# Altium project LUXCON 1_24B.PrjPcb
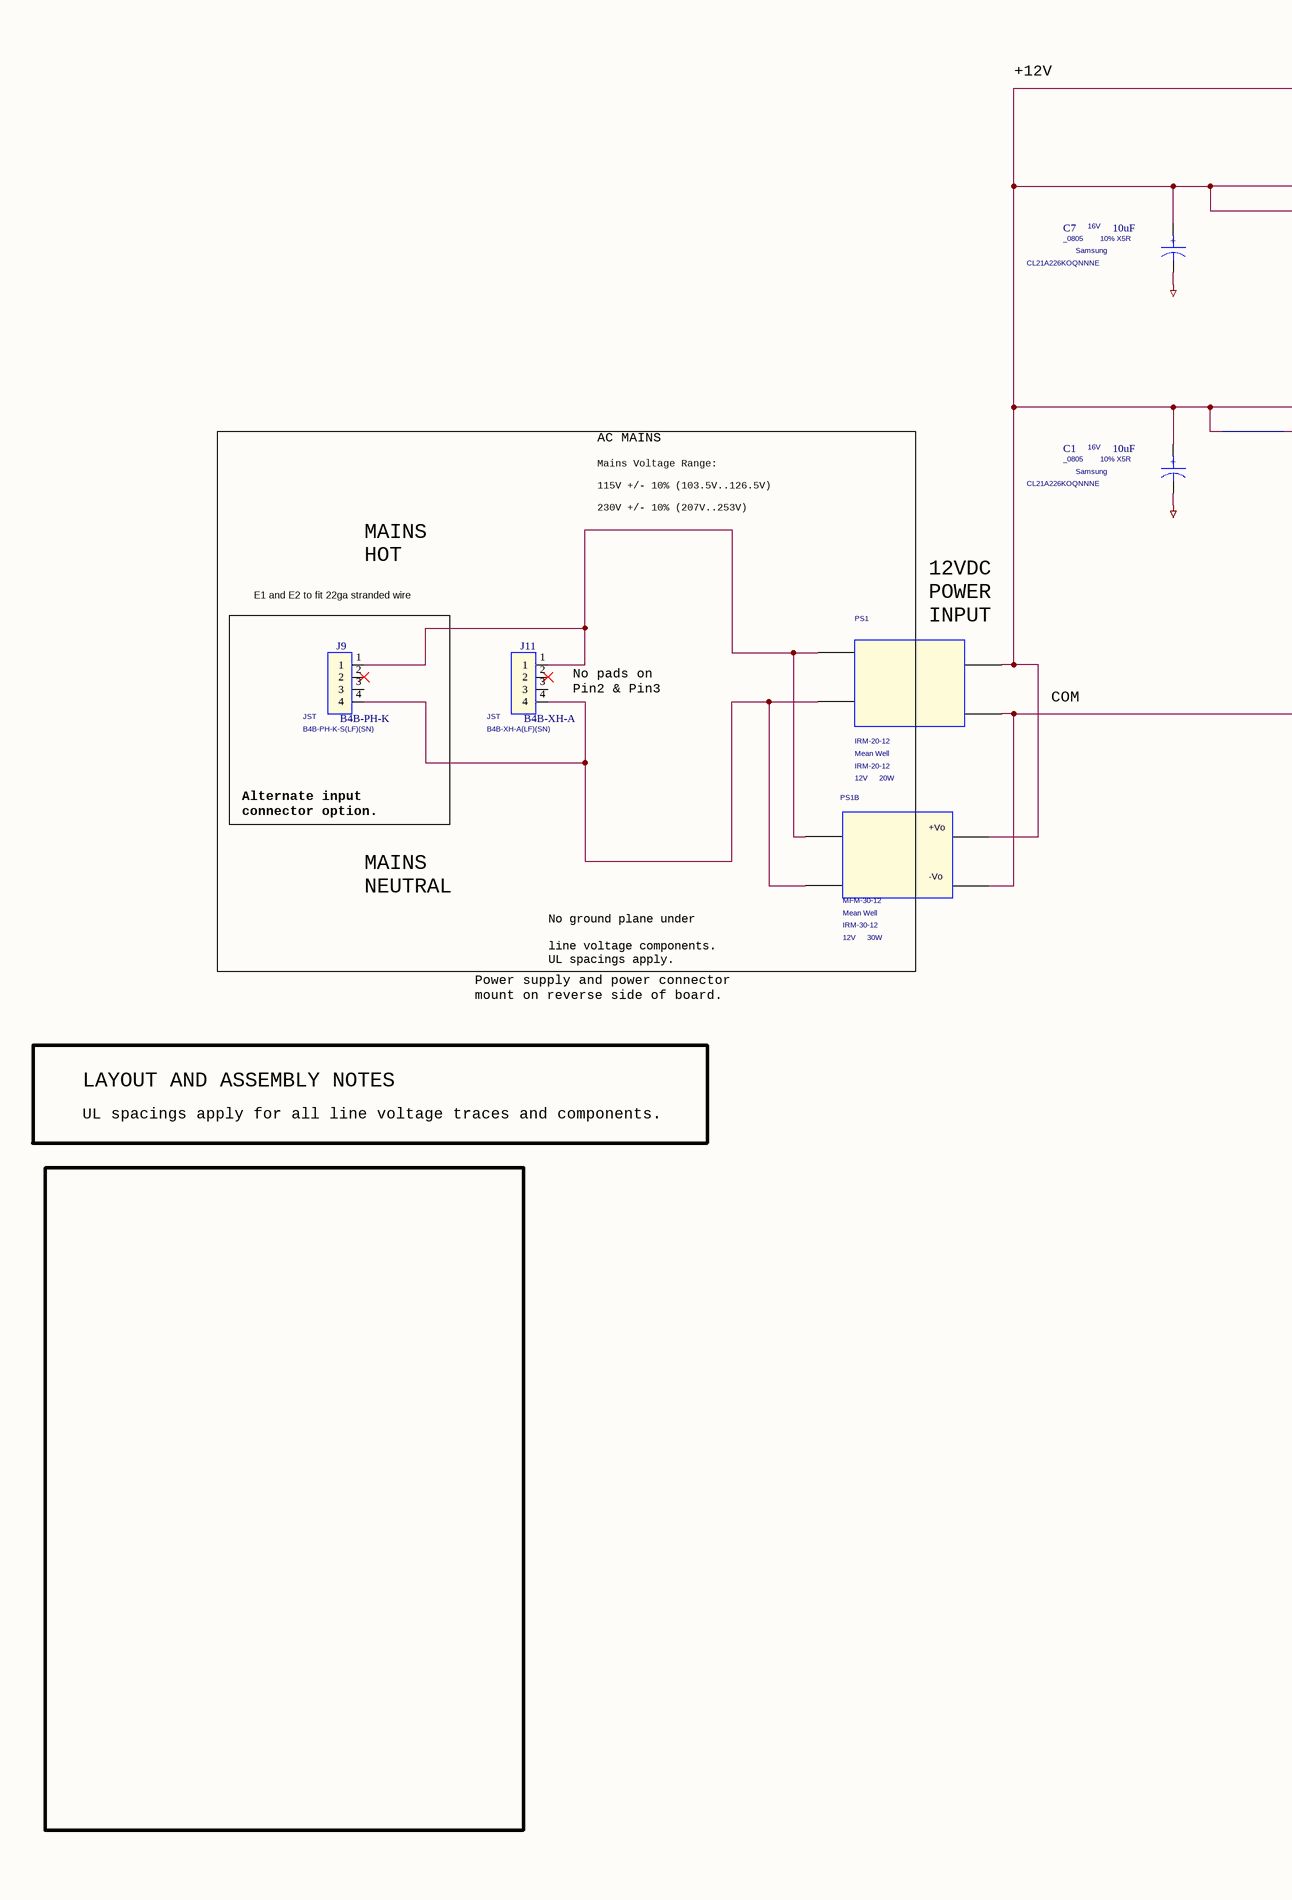
[diagram p0: PAGE1-Power.SchDoc, left]
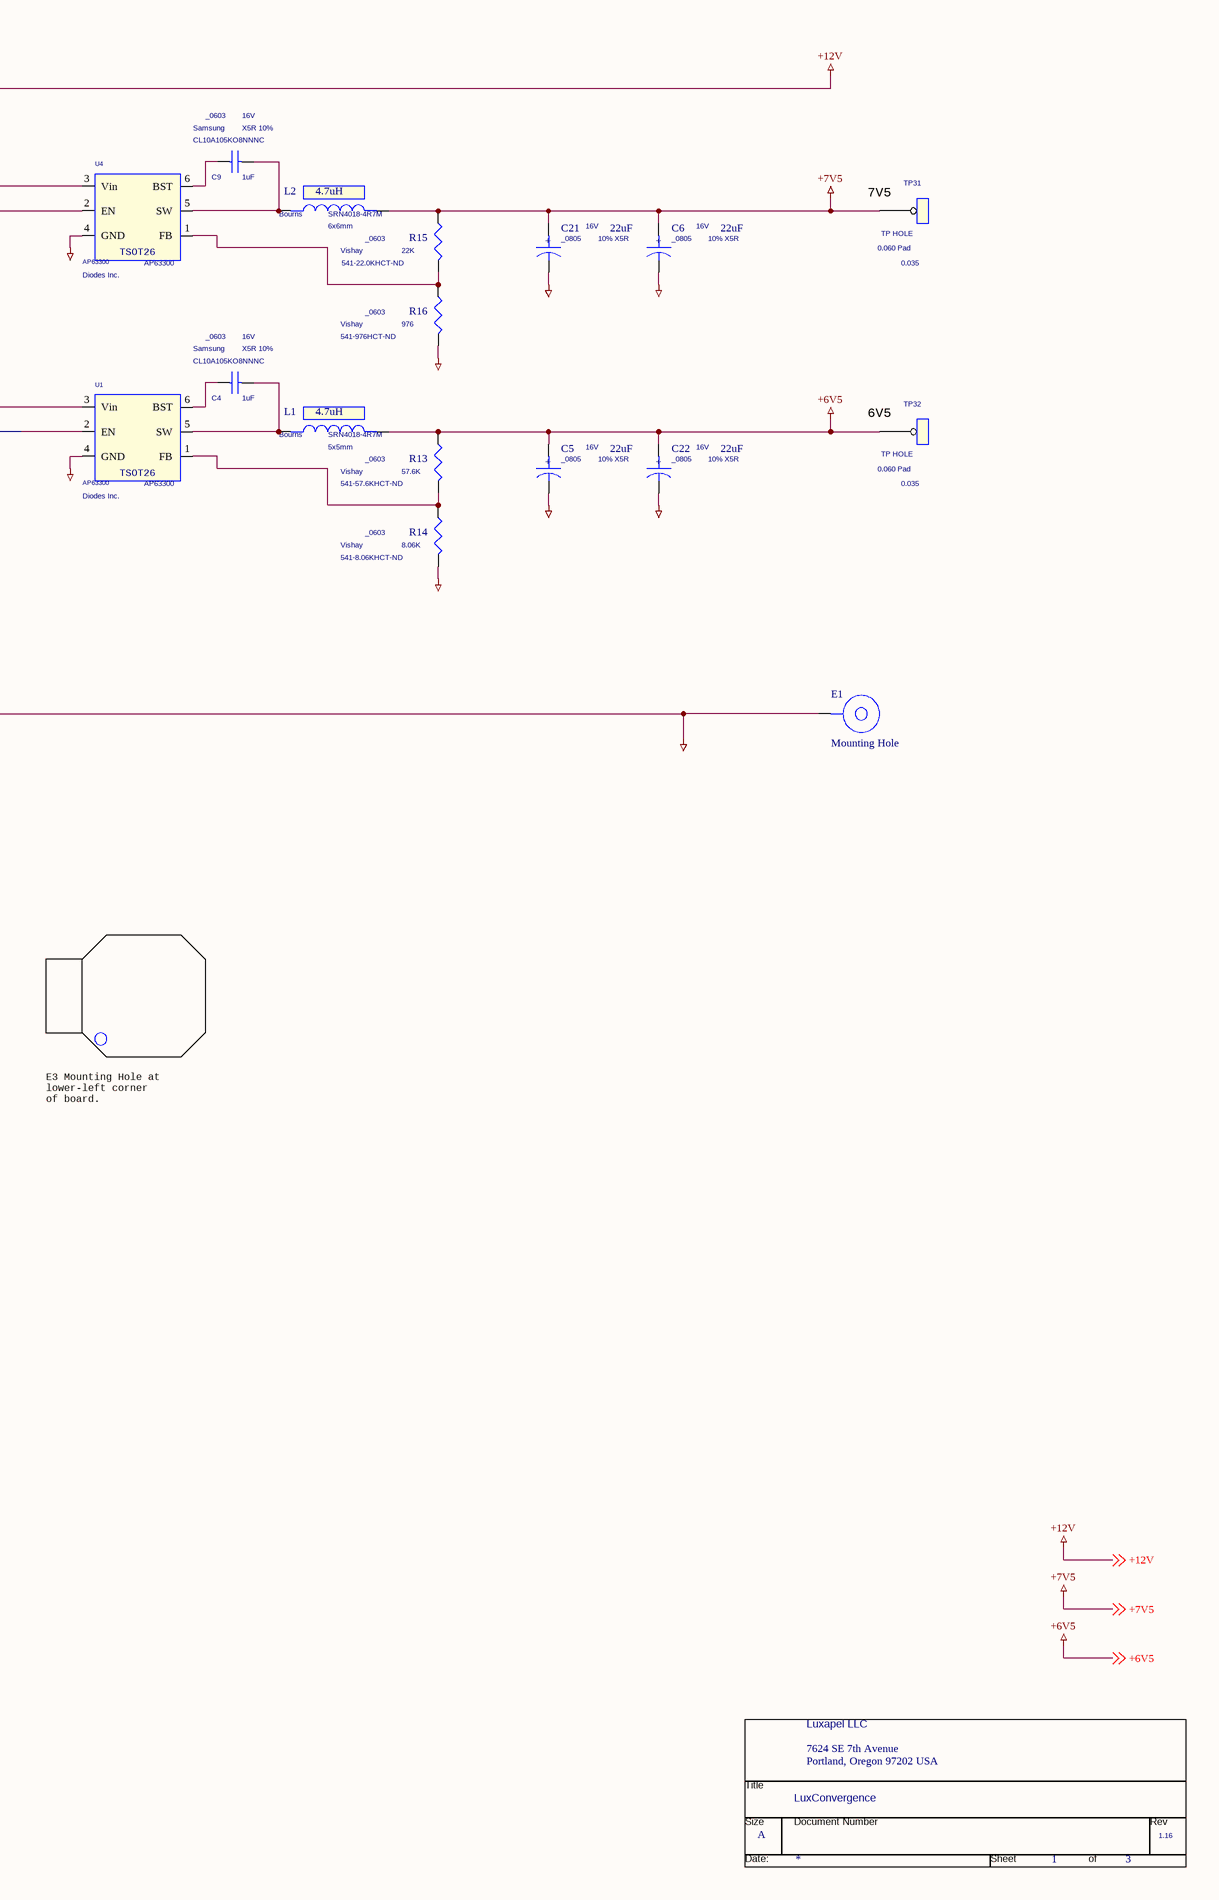
[diagram p1: PAGE1-Power.SchDoc, right]
3 sheets, 67 parts. Net scope: global (net labels, ports and power ports of the same name join across sheets).
Board file: LUX_35.PcbDoc
Sheets:
  PAGE1-Power.SchDoc
  PAGE2-CPU.SchDoc
  PAGE3-LED_Drivers.SchDoc

## Sheet PAGE1-Power.SchDoc
size 513 x 386 mm

### Parts
(Parts that share a designator on the sheet are numbered #1, #2 ... from top to bottom, then left to right.)
*#1  RevCode: 1.16  Title: LuxConvergence  OrgName: Luxapel LLC  OrgAddr1: 7624 SE 7th Avenue  OrgAddr2: Portland, Oregon 97202 USA  Page Size: A  Page Number: 1  Page Count: 3  (hidden comment: TitleBlock3)  (graphical)
C1  10uF  Precision: 10% X5R  Voltage: 16V  Mfg: Samsung  P/N: CL21A226KOQNNNE  [_0805]
C4  1uF  Precision: X5R 10%  Voltage: 16V  Mfg: Samsung  P/N: CL10A105KO8NNNC  [_0603]
C5  22uF  Precision: 10% X5R  Voltage: 16V  [_0805]
C6  22uF  Precision: 10% X5R  Voltage: 16V  [_0805]
C7  10uF  Precision: 10% X5R  Voltage: 16V  Mfg: Samsung  P/N: CL21A226KOQNNNE  [_0805]
C9  1uF  Precision: X5R 10%  Voltage: 16V  Mfg: Samsung  P/N: CL10A105KO8NNNC  [_0603]
C21  22uF  Voltage: 16V  Precision: 10% X5R  [_0805]
C22  22uF  Voltage: 16V  Precision: 10% X5R  [_0805]
E1  Mounting Hole  [MountingHole]
J9  B4B-PH-K  P/N: B4B-PH-K-S(LF)(SN)  Mfg: JST  [SIP-4]
J11  B4B-XH-A  P/N: B4B-XH-A(LF)(SN)  Mfg: JST  [SIP-4]
L1  4.7uH  P/N: SRN4018-4R7M  Mfg: Bourns  [5x5mm]
L2  4.7uH  Mfg: Bourns  P/N: SRN4018-4R7M  [6x6mm]
PS1  IRM-20-12  Mfg: Mean Well  Voltage: 12V  Power: 20W  [ThruHolePS]
PS1B  MFM-30-12  Mfg: Mean Well  P/N: IRM-30-12  Voltage: 12V  Power: 30W  [THRUHOLEPS - duplicate]
R13  57.6K  P/N: 541-57.6KHCT-ND  Mfg: Vishay  [_0603]
R14  8.06K  P/N: 541-8.06KHCT-ND  Mfg: Vishay  [_0603]
R15  22K  P/N: 541-22.0KHCT-ND  Mfg: Vishay  [_0603]
R16  976  P/N: 541-976HCT-ND  Mfg: Vishay  [_0603]
TP31  TP HOLE  Notes: 0.060 Pad  [0.035]
TP32  TP HOLE  Notes: 0.060 Pad  [0.035]
U1  AP63300  Mfg: Diodes Inc.  [SOIC-8]
U4  AP63300  Mfg: Diodes Inc.  [SOIC-8]

### Blocks framed on the sheet
AC MAINS: J11 PS1 PS1B
E1 and E2 to fit 22ga stranded wire: J9

### Nets
+6V5: C5.1 C22.1 L1.1 R13.1 TP32.1 ; off-sheet +6V5
+7V5: C6.1 C21.1 L2.1 R15.1 TP31.1 ; off-sheet +7V5
+12V: C1.1 C7.1 PS1.+Vo PS1B.+Vo U1.2(EN) U1.3(Vin) U4.2(EN) U4.3(Vin) ; off-sheet +12V
GND_POWER.global: C1.2 C5.2 C6.2 C7.2 C21.2 C22.2 E1.1 PS1.-Vo PS1B.-Vo R14.2 R16.2 U1.4(GND) U4.4(GND)
NetC4_1: C4.1 U1.6(BST)
NetC4_2: C4.2 L1.2 U1.5(SW)
NetC9_1: C9.1 U4.6(BST)
NetC9_2: C9.2 L2.2 U4.5(SW)
NetJ9_1: J9.1 J11.1 PS1.ACL PS1B.ACN
NetJ9_4: J9.4 J11.4 PS1.ACN PS1B.ACL
NetR13_2: R13.2 R14.1 U1.1(FB)
NetR15_2: R15.2 R16.1 U4.1(FB)

Not connected (* = marked no-connect by the designer): J9 2* 3; J11 2* 3

### Notes on the sheet
- +12V
- (near TP31) 7V5
- (near TP32) 6V5
- Mains Voltage Range:
  115V +/- 10% (103.5V..126.5V)
  230V +/- 10% (207V..253V)
- MAINS
  HOT
- (near PS1) 12VDC
  POWER
  INPUT
- (near J11) No pads on
  Pin2 & Pin3
- COM
- Alternate input
  connector option.
- (near PS1B) +Vo
- MAINS
  NEUTRAL
- (near PS1B) -Vo
- No ground plane under
  line voltage components.
  UL spacings apply.
- Power supply and power connector
  mount on reverse side of board.
- LAYOUT AND ASSEMBLY NOTES
- E3 Mounting Hole at
  lower-left corner
  of board.
- UL spacings apply for all line voltage traces and components.
- (in symbol CAPACITOR POL/SM) +
- (in symbol NCP3170_0_2) TSOT26
- (in symbol TitleBlock3) Title; Size; Document Number; Rev; Date:; Sheet; of

### Library data of the parts
*#1 = TitleBlock3: Doc: LuxConvergence_1_0; Page Create Date: March  8, 1995; Page Modify Date: *
C1 C7 = CAPACITOR POL/SM: PCB Footprint: _0805
C4 C9 = CAPACITOR NON-POL: Name: I16777427; Pin Numbers Visible: False; EDIForiginalOrigin: (pt 0 0); EDIFviewName: NORMAL; Implementation Type: <none>; Color: Default; Pin Names Visible: False; Graphic: CAPACITOR NON-POL; DataSheet: Yes; PCB Footprint: _0603
C5 C6 = CAPACITOR POL/SM: Mfg: Samsung; P/N: CL21A226KOQNNNE; PCB Footprint: _0805
C21 C22 = CAPACITOR POL/SM: P/N: CL21A226KOQNNNE; Mfg: Samsung; PCB Footprint: _0805
E1 = hole_0: OrCADviewType: LIBRARY_PART; Name: hole.Normal; Pin Numbers Visible: False; EDIForiginalOrigin: (pt 0 10); EDIFviewName: NORMAL; Pin Names Visible: False; PCB Footprint: MountingHole
J9 J11 = CON4_8: DataSheet: Yes; PCB Footprint: SIP-4
L1 L2 = INDUCTOR FERRITE/SM: Power: 1A
  L1: PCB Footprint: 5x5mm
  L2: PCB Footprint: 6x6mm
PS1 = VOFM-5-5: Pin Numbers Visible: True; EDIForiginalOrigin: (pt 0 0); EDIFviewName: NORMAL; Implementation Type: <none>; Graphic: VOFM-5-5.Normal; Pin Names Visible: True; PCB Footprint: ThruHolePS; Color: Default; P/N: IRM-20-12; DataSheet: Yes
PS1B = VOFM-5-5_5: EDIFviewName: NORMAL; EDIForiginalOrigin: (pt 0 0); Pin Names Visible: True; Implementation Type: <none>; Graphic: VOFM-5-5.Normal; PCB Footprint: ThruHolePS; Pin Numbers Visible: True; Color: Default; DataSheet: Yes
R13-R16 = RESISTOR: Voltage: 75V; Precision: 5%; Power: 0.10W; PCB Footprint: _0603
TP31 TP32 = TEST POINT_1: OrCADviewType: LIBRARY_PART; Name: I16753259; Pin Numbers Visible: False; Pin Names Visible: True; EDIForiginalOrigin: (pt 0 0); EDIFviewName: NORMAL; Implementation Type: <none>; PCB Footprint: 0.035; Color: Default; Graphic: TEST POINT; DataSheet: Yes
U1 U4 = NCP3170_0_2: PCB Footprint: SOIC-8; P/N: AP63300

## Sheet PAGE2-CPU.SchDoc
size 513 x 386 mm
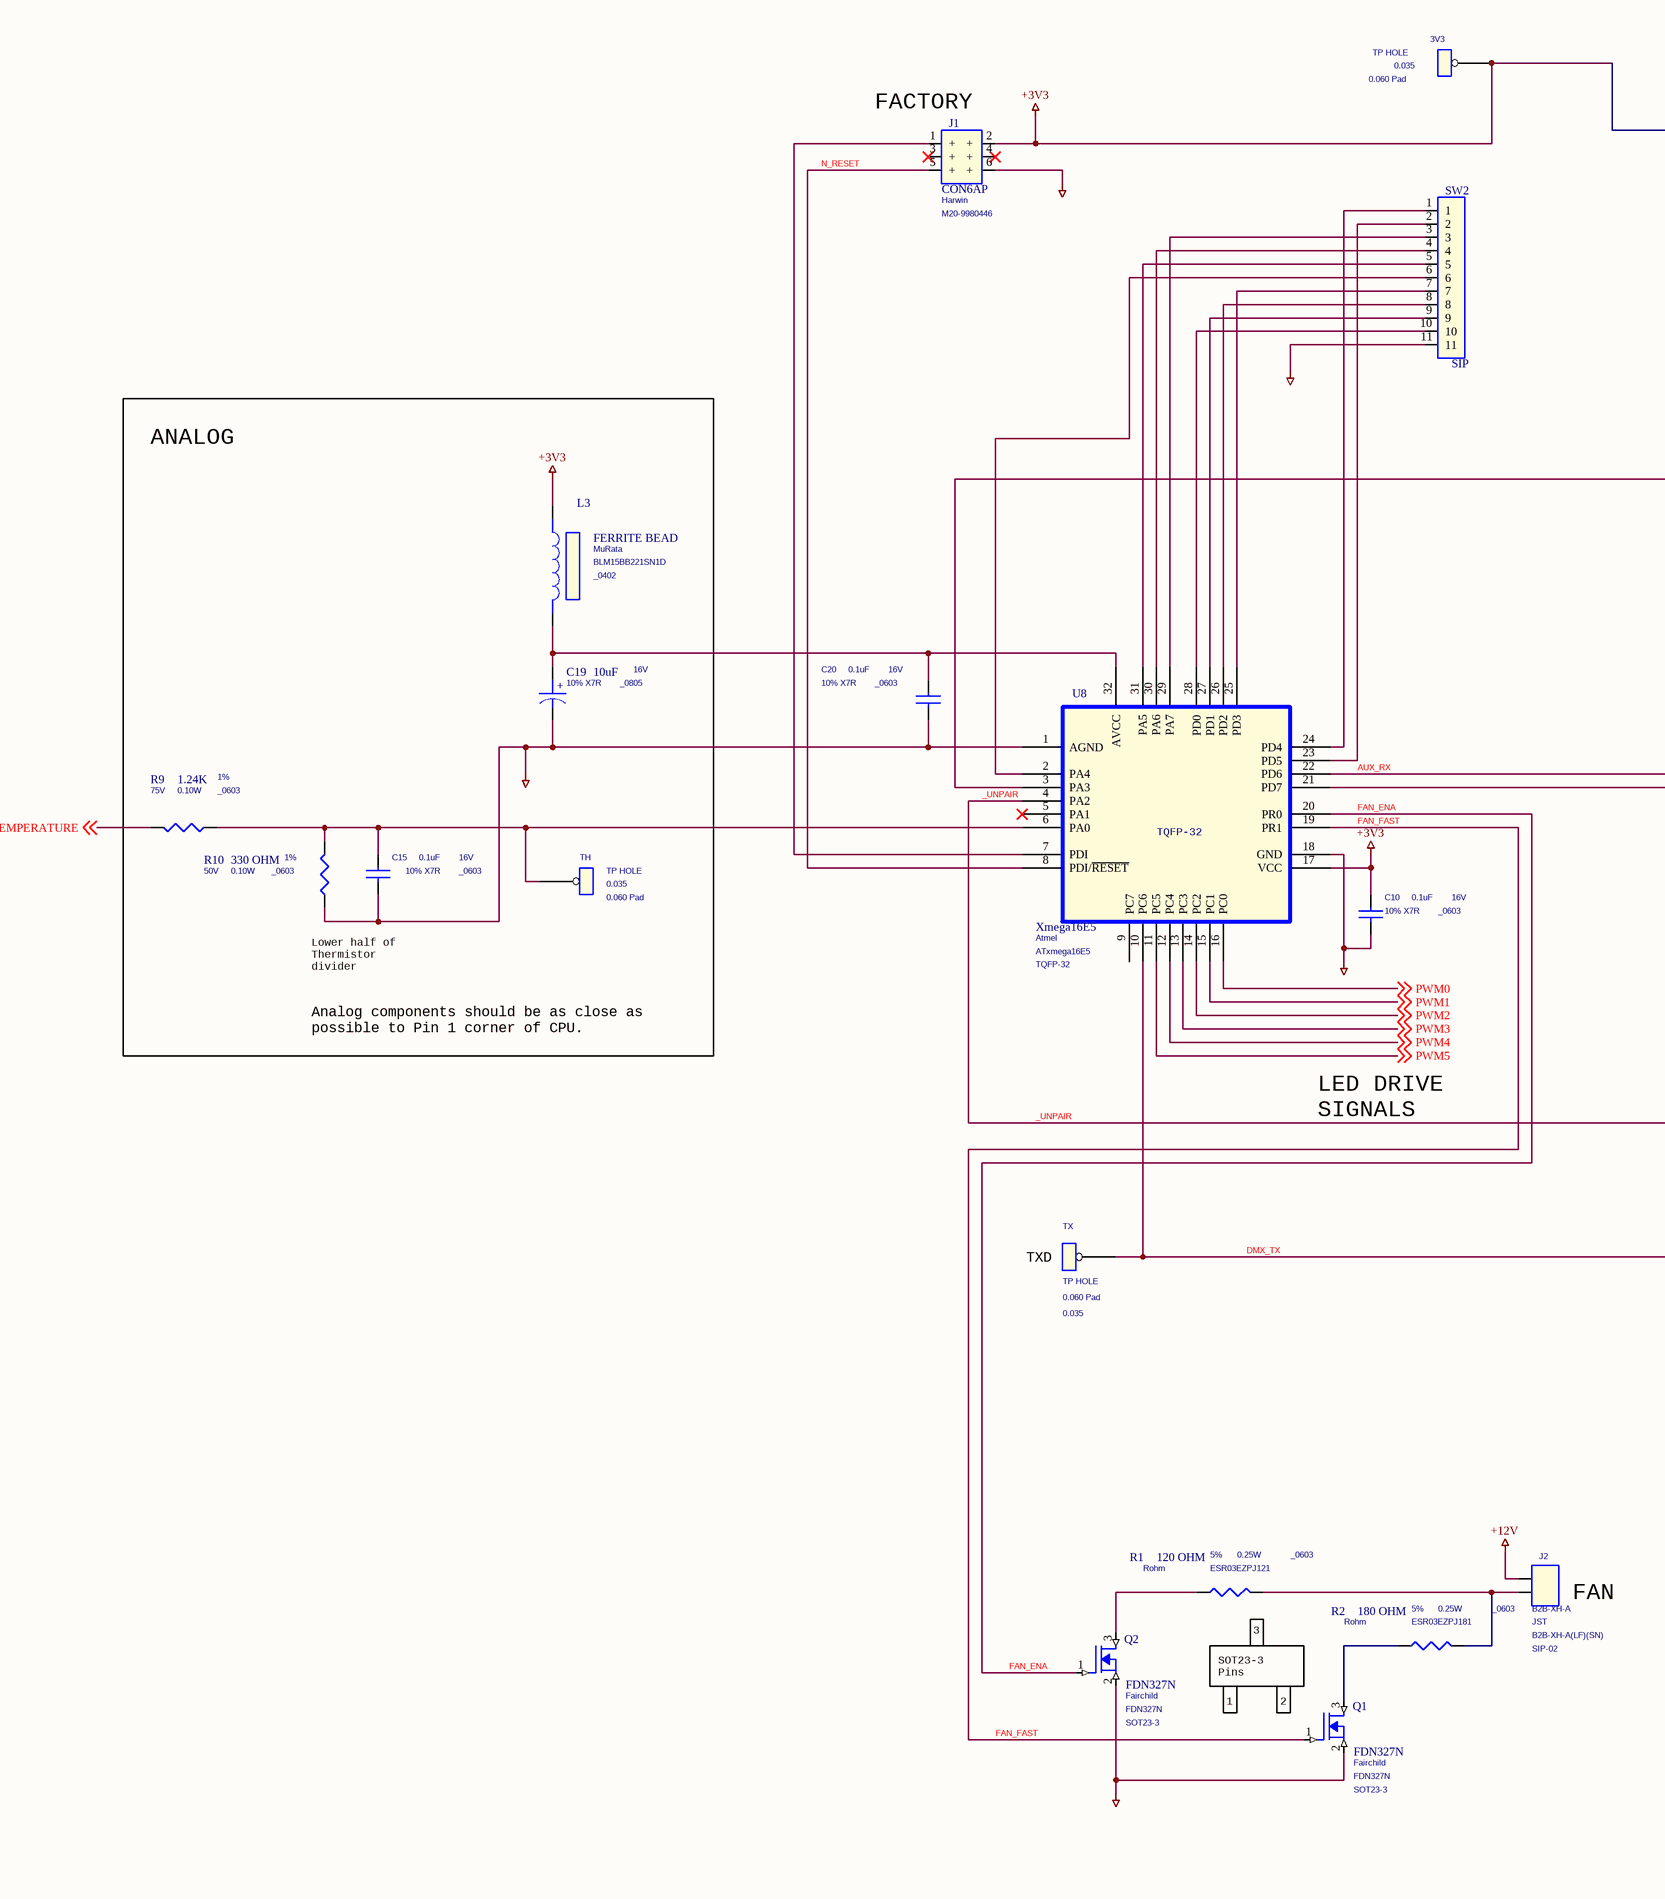
[diagram p2: PAGE2-CPU.SchDoc, left]
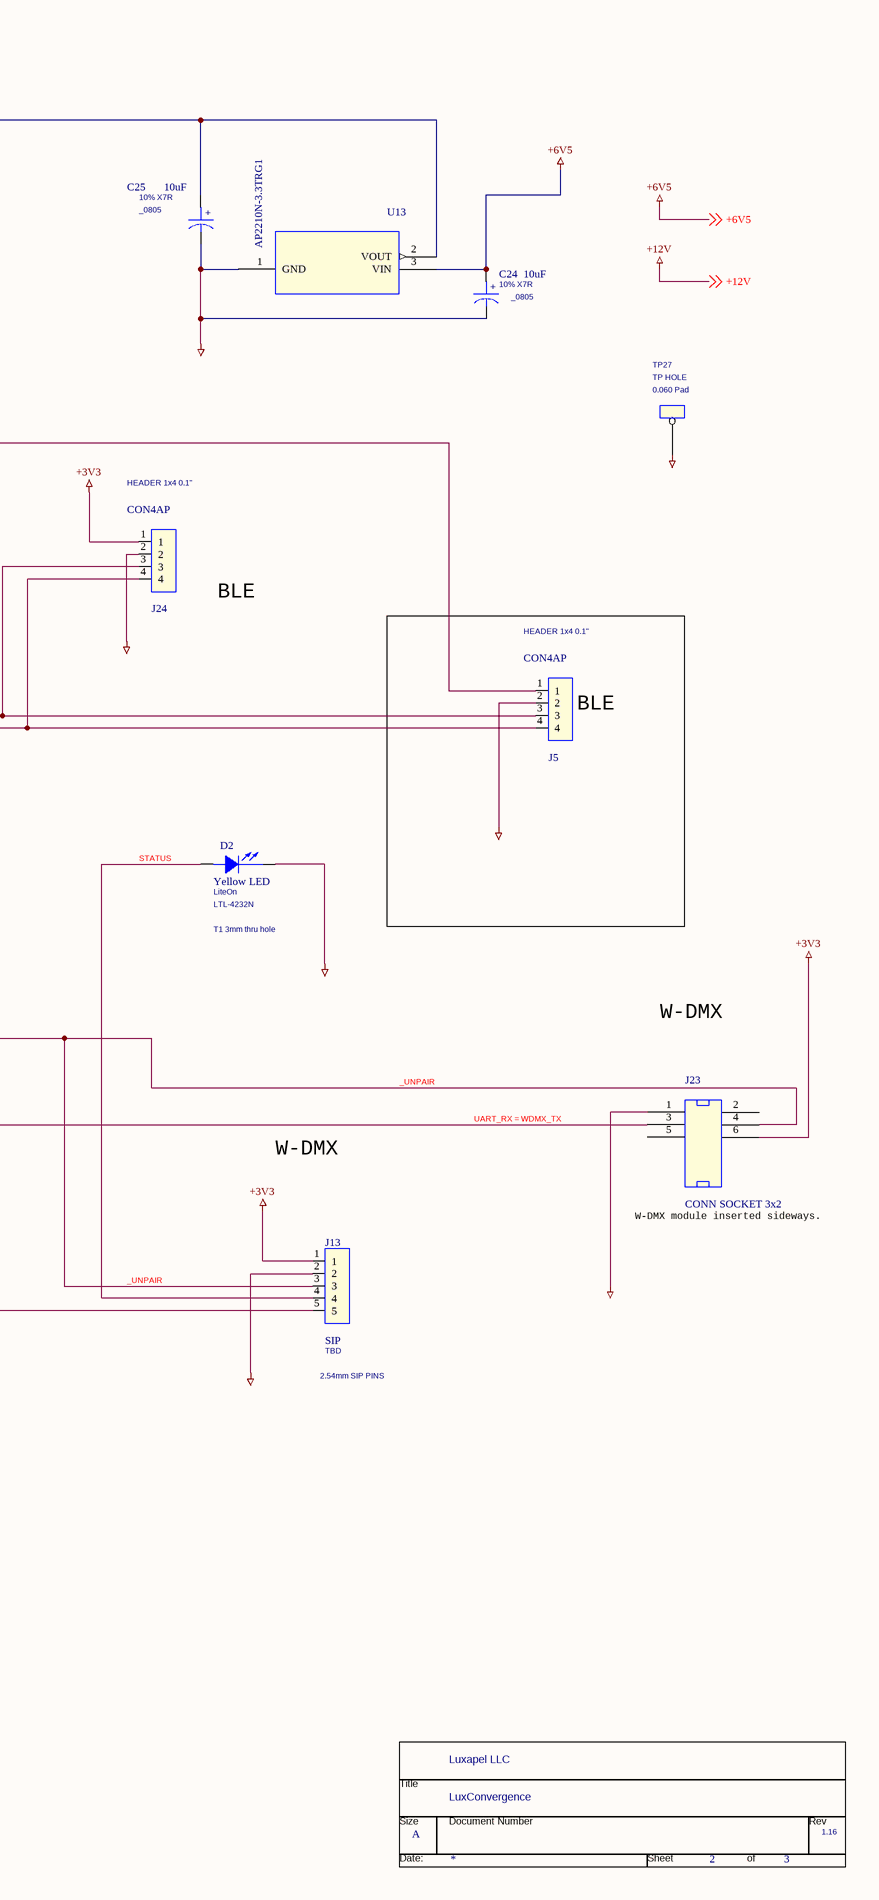
[diagram p3: PAGE2-CPU.SchDoc, right]

### Parts
(Parts that share a designator on the sheet are numbered #1, #2 ... from top to bottom, then left to right.)
3V3  TP HOLE  Notes: 0.060 Pad  [0.035]
*#2  RevCode: 1.16  Title: LuxConvergence  OrgName: Luxapel LLC  Page Size: A  Page Number: 2  Page Count: 3  (hidden comment: TitleBlock1)  (graphical)
C10  0.1uF  Voltage: 16V  Precision: 10% X7R  [_0603]
C15  0.1uF  Precision: 10% X7R  Voltage: 16V  [_0603]
C19  10uF  Voltage: 16V  Precision: 10% X7R  [_0805]
C20  0.1uF  Precision: 10% X7R  Voltage: 16V  [_0603]
C24  10uF  Precision: 10% X7R  [_0805]
C25  10uF  Precision: 10% X7R  [_0805]
D2  Yellow LED  Mfg: LiteOn  P/N: LTL-4232N  [T1 3mm thru hole]
J1  CON6AP  Mfg: Harwin  P/N: M20-9980446  [2x4]
J2  B2B-XH-A  P/N: B2B-XH-A(LF)(SN)  Mfg: JST  [SIP-02]
J5  CON4AP  [HEADER 1x4 0.1"]
J13  SIP  Mfg: TBD  P/N: 2.54mm SIP PINS  [SIP-4]
J23  CONN SOCKET 3x2  [2X3]
J24  CON4AP  PCB Footprint: HEADER 1x4 0.1"  [SIP-4PA]
L3  FERRITE BEAD  Mfg: MuRata  P/N: BLM15BB221SN1D  [_0402]
Q1  FDN327N  Mfg: Fairchild  [SOT23-3]
Q2  FDN327N  Mfg: Fairchild  [SOT23-3]
R1  120 OHM  Precision: 5%  Power: 0.25W  P/N: ESR03EZPJ121  Mfg: Rohm  [_0603]
R2  180 OHM  Precision: 5%  Power: 0.25W  P/N: ESR03EZPJ181  Mfg: Rohm  [_0603]
R9  1.24K  Power: 0.10W  Voltage: 75V  Precision: 1%  [_0603]
R10  330 OHM  Voltage: 50V  Precision: 1%  Power: 0.10W  [_0603]
SW2  SIP  [SIP-4]
TH  TP HOLE  Notes: 0.060 Pad  [0.035]
TP27  TP HOLE  Notes: 0.060 Pad  [0.035]
TX  TP HOLE  Notes: 0.060 Pad  [0.035]
U8  Xmega16E5  P/N: ATxmega16E5  Mfg: Atmel  [TQFP-32]
U13  AP2210N-3.3TRG1  [FP-SOT23-IPC_A]

### Blocks framed on the sheet
ANALOG: C15 C19 L3 R9 R10 TH
BLE: J5

### Nets
+3V3: 3V3.1 C10.1 C25.1 J1.2(+) J13.1 J23.6 J24.1 L3.2 U8.17(VCC) U13.2(VOUT)
+6V5: C24.1 U13.3(VIN) ; off-sheet +6V5
+12V: J2.1 ; off-sheet +12V
GND_POWER.global: C10.2 C15.2 C19.2 C20.2 C24.2 C25.2 D2.2(CATHODE) J1.6(+) J5.2 J13.2 J23.1 J24.2 Q1.2(SOURCE) Q2.2(SOURCE) R10.2 SW2.11 TP27.1 U8.1(AGND) U8.18(GND) U13.1(GND)
_UNPAIR: J13.3 J23.4 U8.4(PA2)
AUX_RX: J5.3 J24.3 U8.22(PD6)
DMX_TX: J13.5 J23.3 TX.1 U8.10(PC6)  [also labelled UART_RX = WDMX_TX]
FAN_ENA: Q2.1(GATE) U8.20(PR0)
FAN_FAST: Q1.1(GATE) U8.19(PR1)
N_RESET: J1.5(+) U8.8(PDI/~{RESET})
PWM0: U8.16(PC0) ; off-sheet PWM0
PWM1: U8.15(PC1) ; off-sheet PWM1
PWM2: U8.14(PC2) ; off-sheet PWM2
PWM3: U8.13(PC3) ; off-sheet PWM3
PWM4: U8.12(PC4) ; off-sheet PWM4
PWM5: U8.11(PC5) ; off-sheet PWM5
STATUS: D2.1(ANODE) J13.4
TEMPERATURE: R9.1 ; off-sheet TEMPERATURE
NetC15_1: C15.1 R9.2 R10.1 TH.1 U8.6(PA0)
NetC19_1: C19.1 C20.1 L3.1 U8.32(AVCC)
NetJ1_1: J1.1(+) U8.7(PDI)
NetJ2_2: J2.2 R1.2 R2.2
NetJ5_1: J5.1 U8.3(PA3)
NetJ5_4: J5.4 J24.4 U8.21(PD7)
NetQ1_3: Q1.3(DRAIN) R2.1
NetQ2_3: Q2.3(DRAIN) R1.1
NetSW2_1: SW2.1 U8.24(PD4)
NetSW2_2: SW2.2 U8.23(PD5)
NetSW2_3: SW2.3 U8.29(PA7)
NetSW2_4: SW2.4 U8.30(PA6)
NetSW2_5: SW2.5 U8.31(PA5)
NetSW2_6: SW2.6 U8.2(PA4)
NetSW2_7: SW2.7 U8.25(PD3)
NetSW2_8: SW2.8 U8.26(PD2)
NetSW2_9: SW2.9 U8.27(PD1)
NetSW2_10: SW2.10 U8.28(PD0)

Not connected (* = marked no-connect by the designer): J1 3(+)* 4(+)*; J23 2(7) 5(3); U8 5(PA1)* 9(PC7)

### Notes on the sheet
- (near J1) FACTORY
- BLE
- Lower half of
  Thermistor
  divider
- Analog components should be as close as
  possible to Pin 1 corner of CPU.
- LED DRIVE
  SIGNALS
- W-DMX
- (near TX) TXD
- W-DMX module inserted sideways.
- (near R1) 3
- (near J2) FAN
- SOT23-3
  Pins
- 1
- (near Q1) 2
- (in symbol CAPACITOR POL/SM) +
- (in symbol TitleBlock1) Title; Size; Document Number; Rev; Date:; Sheet; of

### Library data of the parts
3V3 TH TP27 TX = TEST POINT_1: as TP31 on sheet PAGE1-Power; DataSheet: Yes; Graphic: TEST POINT; Color: Default; PCB Footprint: 0.035
*#2 = TitleBlock1: Doc: LuxConvergence_1_0; Page Create Date: March  8, 1995; Page Modify Date: *
C10 = CAPACITOR NON-POL: Name: I16777427; Pin Numbers Visible: False; EDIForiginalOrigin: (pt 0 0); EDIFviewName: NORMAL; Implementation Type: <none>; Color: Default; Mfg: AVX; P/N: 0603YC104KAT2A; Pin Names Visible: False; PCB Footprint: _0603; Graphic: CAPACITOR NON-POL; DataSheet: Yes
C15 = CAPACITOR NON-POL: Name: I16777291; Pin Numbers Visible: False; EDIForiginalOrigin: (pt 0 0); EDIFviewName: NORMAL; P/N: 0603YC104KAT2A; Mfg: AVX; Color: Default; Implementation Type: <none>; Pin Names Visible: False; PCB Footprint: _0603; DataSheet: Yes; Graphic: CAPACITOR NON-POL
C19 = CAPACITOR POL/SM: P/N: CL21B106KOQNNNE; Mfg: Samsung; PCB Footprint: _0805
C20 = CAPACITOR NON-POL: Name: I16777427; Pin Numbers Visible: False; EDIForiginalOrigin: (pt 0 0); EDIFviewName: NORMAL; P/N: 0603YC104KAT2A; Mfg: AVX; Color: Default; Implementation Type: <none>; Pin Names Visible: False; DataSheet: Yes; Graphic: CAPACITOR NON-POL; PCB Footprint: _0603
C24 = CAPACITOR POL/SM: Voltage: 16V; Mfg: Samsung; P/N: CL21B106KOQNNNE; PCB Footprint: _0805
C25 = CAPACITOR POL/SM: P/N: CL21B106KOQNNNE; Mfg: Samsung; Voltage: 16V; PCB Footprint: _0805
D2 = LED: PCB Footprint: T1 3mm thru hole
J1 = CON8AP_0: PCB Footprint: 2x4
J2 = CON2: Pin Numbers Visible: True; EDIForiginalOrigin: (pt 0 0); EDIFviewName: NORMAL; Graphic: CON2.Normal; Implementation Type: <none>; Pin Names Visible: True; Color: Default; PCB Footprint: SIP-02
J5 J24 = CON4AP_5
  J5: PCB Footprint: HEADER 1x4 0.1"
J13 = CON4_9: DataSheet: Yes; PCB Footprint: SIP-4
J23 = CONN SOCKET 6x2_0
L3 = INDUCTOR FERRITE/SM: PCB Footprint: _0402
Q1 Q2 = N DGS_0: Voltage: 20V; Power: 2A; P/N: FDN327N; PCB Footprint: SOT23-3
R1 R2 = RESISTOR/SM: Voltage: 50V; PCB Footprint: _0603
R9 = RESISTOR/SM: Mfg: Vishay; P/N: CRCW06031K24FKEB; PCB Footprint: _0603
R10 = RESISTOR/SM: Mfg: Stackpole; P/N: RMCF0603FT330R; PCB Footprint: _0603
SW2 = CON4_10: Mfg: TBD; P/N: 2mm SIP PINS; PCB Footprint: SIP-4; DataSheet: Yes
U8 = Xmega8E5: PCB Footprint: TQFP-32
U13 = AP2210N-3P3TRG1: Vendor: Diodes Inc; Built_By: EMAMatt; SourceLibrary: DiodesInc2019-12-05; PCB Footprint: SOT_3P3TRG1_DIO; Manufacturer_Part_Number: AP2210N-3.3TRG1; Copyright: Copyright (C) 2018 Accelerated Designs. All rights reserved

## Sheet PAGE3-LED_Drivers.SchDoc
size 513 x 386 mm
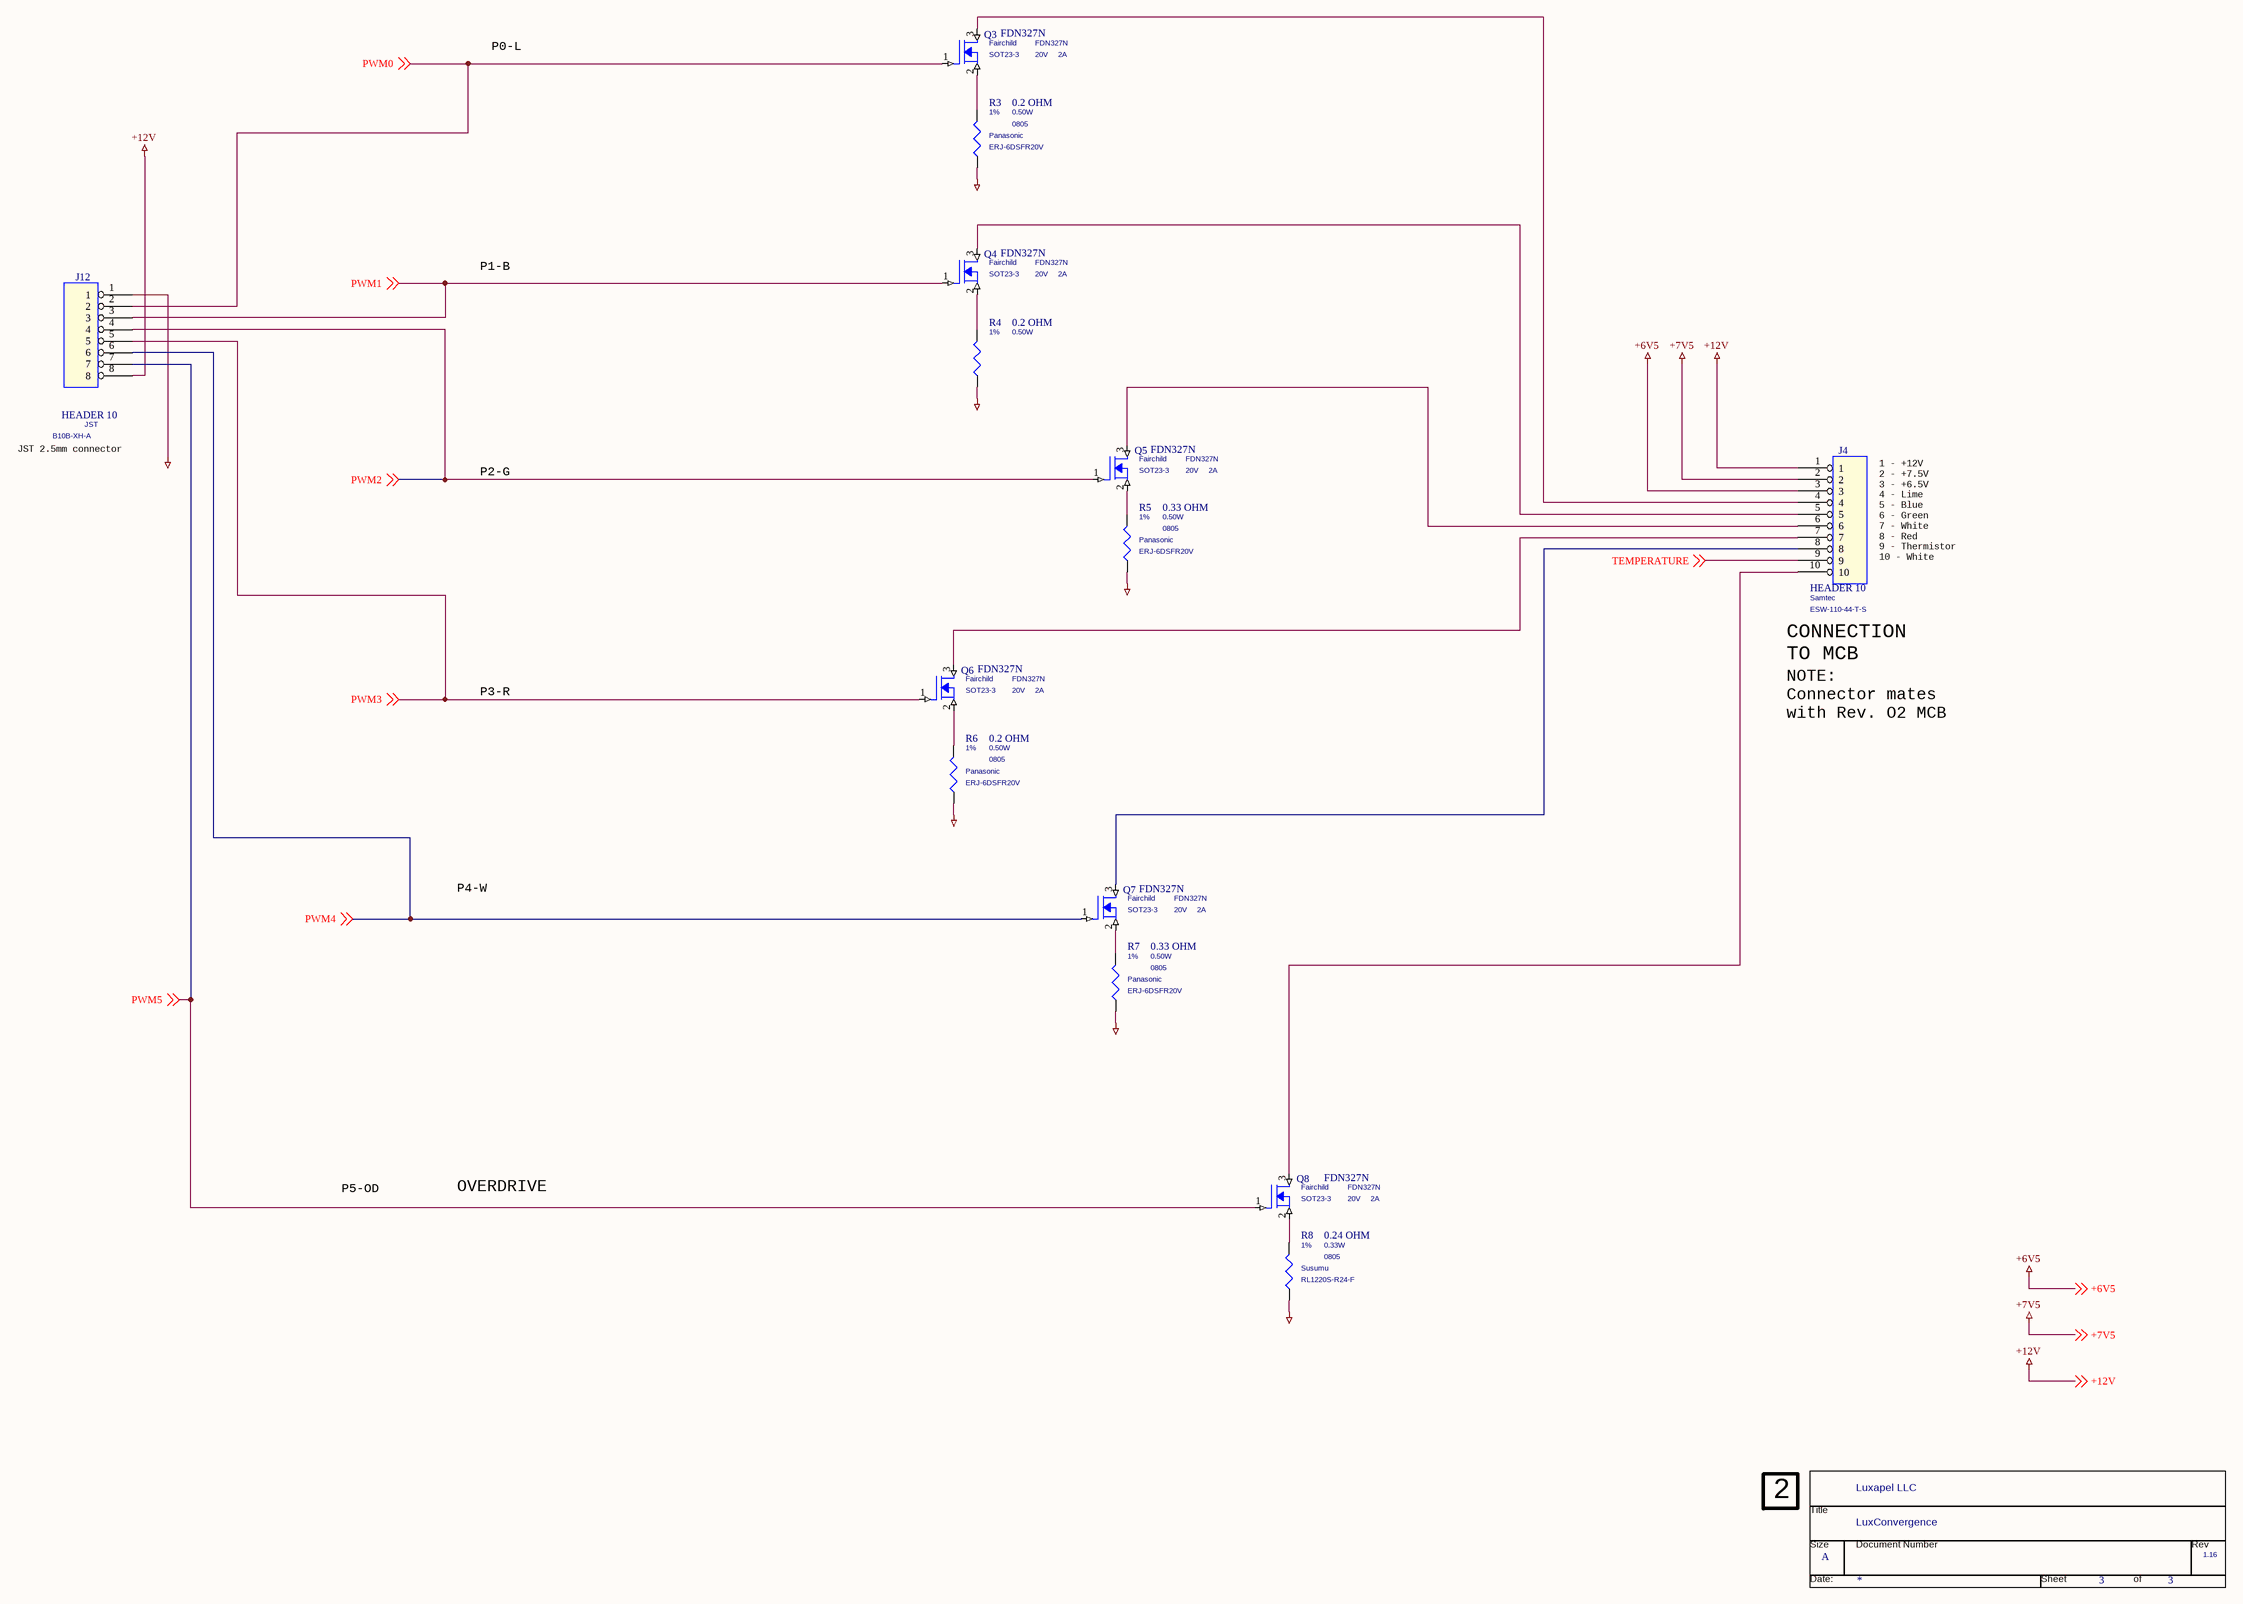
[diagram p4: PAGE3-LED_Drivers.SchDoc]

### Parts
(Parts that share a designator on the sheet are numbered #1, #2 ... from top to bottom, then left to right.)
*#3  RevCode: 1.16  Title: LuxConvergence  OrgName: Luxapel LLC  Page Size: A  Page Number: 3  (hidden comment: TitleBlock1)  (graphical)
J4  HEADER 10  Mfg: Samtec  P/N: ESW-110-44-T-S  [SIP-10]
J12  HEADER 10  Mfg: JST  P/N: B10B-XH-A  [SIP-10]
Q3  FDN327N  Voltage: 20V  Power: 2A  Mfg: Fairchild  [SOT23-3]
Q4  FDN327N  Voltage: 20V  Power: 2A  Mfg: Fairchild  [SOT23-3]
Q5  FDN327N  Mfg: Fairchild  Power: 2A  Voltage: 20V  [SOT23-3]
Q6  FDN327N  Mfg: Fairchild  Power: 2A  Voltage: 20V  [SOT23-3]
Q7  FDN327N  Mfg: Fairchild  Power: 2A  Voltage: 20V  PCB Footprint: SOT23-3  [SOT23-323]
Q8  FDN327N  Voltage: 20V  Power: 2A  Mfg: Fairchild  [SOT23-3]
R3  0.2 OHM  Mfg: Panasonic  P/N: ERJ-6DSFR20V  Precision: 1%  Power: 0.50W  [0805]
R4  0.2 OHM  Precision: 1%  Power: 0.50W  [1210]
R5  0.33 OHM  Mfg: Panasonic  P/N: ERJ-6DSFR20V  Precision: 1%  Power: 0.50W  PCB Footprint: 0805  [_0805]
R6  0.2 OHM  Mfg: Panasonic  P/N: ERJ-6DSFR20V  Precision: 1%  Power: 0.50W  [0805]
R7  0.33 OHM  Mfg: Panasonic  P/N: ERJ-6DSFR20V  Precision: 1%  Power: 0.50W  PCB Footprint: 0805  [_0805]
R8  0.24 OHM  Mfg: Susumu  P/N: RL1220S-R24-F  Precision: 1%  Power: 0.33W  [0805]

### Nets
+6V5: J4.3 ; off-sheet +6V5
+7V5: J4.2 ; off-sheet +7V5
+12V: J4.1 J12.8 ; off-sheet +12V
GND_POWER.global: J12.1 R3.1 R4.1 R5.1 R6.1 R7.1 R8.1
PWM0: J12.2 Q3.1(GATE) ; off-sheet PWM0
PWM1: J12.3 Q4.1(GATE) ; off-sheet PWM1
PWM2: J12.4 Q5.1(GATE) ; off-sheet PWM2
PWM3: J12.5 Q6.1(GATE) ; off-sheet PWM3
PWM4: J12.6 Q7.1(GATE) ; off-sheet PWM4
PWM5: J12.7 Q8.1(GATE) ; off-sheet PWM5
TEMPERATURE: J4.9 ; off-sheet TEMPERATURE
NetJ4_4: J4.4 Q3.3(DRAIN)
NetJ4_5: J4.5 Q4.3(DRAIN)
NetJ4_6: J4.6 Q5.3(DRAIN)
NetJ4_7: J4.7 Q6.3(DRAIN)
NetJ4_8: J4.8 Q7.3(DRAIN)
NetJ4_10: J4.10 Q8.3(DRAIN)
NetQ3_2: Q3.2(SOURCE) R3.2
NetQ4_2: Q4.2(SOURCE) R4.2
NetQ5_2: Q5.2(SOURCE) R5.2
NetQ6_2: Q6.2(SOURCE) R6.2
NetQ7_2: Q7.2(SOURCE) R7.2
NetQ8_2: Q8.2(SOURCE) R8.2

### Notes on the sheet
- P0-L
- P1-B
- JST 2.5mm connector
- P2-G
- 1 - +12V
  2 - +7.5V
  3 - +6.5V
  4 - Lime
  5 - Blue
  6 - Green
  7 - White
  8 - Red
  9 - Thermistor
  10 - White Alternate
- P3-R
- CONNECTION
  TO MCB
- NOTE:
  Connector mates
  with Rev. O2 MCB
- P4-W
- P5-OD
- OVERDRIVE
- (near *#3) 2
- (in symbol TitleBlock1) Title; Size; Document Number; Rev; Date:; Sheet; of

### Library data of the parts
*#3 = TitleBlock1: Doc: LuxConvergence_1_0; Page Create Date: March  8, 1995; Page Count: 3; Page Modify Date: *
J12 = HEADER 10_0: PCB Footprint: SIP-10
Q3-Q8 = N DGS_0: P/N: FDN327N
  Q3-Q6 Q8: PCB Footprint: SOT23-3
R3 R5-R8 = RESISTOR: Voltage: ?V
  R3 R6 R8: PCB Footprint: 0805
R4 = RESISTOR: Mfg: Panasonic; P/N: ERJ-6DSFR20V; Voltage: ?V; PCB Footprint: 1210
J4 = HEADER 10: PCB Footprint: SIP-10

## Nets that join several sheets
+6V5: PAGE1-Power (5 pins), PAGE2-CPU (C24.1 U13.3), PAGE3-LED_Drivers (J4.3)
+7V5: PAGE1-Power (5 pins), PAGE3-LED_Drivers (J4.2)
+12V: PAGE1-Power (8 pins), PAGE2-CPU (J2.1), PAGE3-LED_Drivers (J4.1 J12.8)
GND_POWER.global: PAGE1-Power (13 pins), PAGE2-CPU (20 pins), PAGE3-LED_Drivers (7 pins)
PWM0: PAGE2-CPU (U8.16), PAGE3-LED_Drivers (J12.2 Q3.1)
PWM1: PAGE2-CPU (U8.15), PAGE3-LED_Drivers (J12.3 Q4.1)
PWM2: PAGE2-CPU (U8.14), PAGE3-LED_Drivers (J12.4 Q5.1)
PWM3: PAGE2-CPU (U8.13), PAGE3-LED_Drivers (J12.5 Q6.1)
PWM4: PAGE2-CPU (U8.12), PAGE3-LED_Drivers (J12.6 Q7.1)
PWM5: PAGE2-CPU (U8.11), PAGE3-LED_Drivers (J12.7 Q8.1)
TEMPERATURE: PAGE2-CPU (R9.1), PAGE3-LED_Drivers (J4.9)